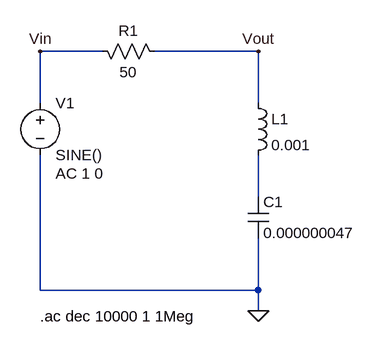
[diagram p0: schematic Notch.asc]
Notch.asc, the LTspice schematic file:
Version 4
SHEET 1 880 680
WIRE 112 32 16 32
WIRE 352 32 192 32
WIRE 16 112 16 32
WIRE 352 112 352 32
WIRE 352 256 352 192
WIRE 16 400 16 192
WIRE 352 400 352 320
WIRE 352 400 16 400
WIRE 352 432 352 400
FLAG 352 432 0
FLAG 16 32 Vin
FLAG 352 32 Vout
SYMBOL voltage 16 96 R0
WINDOW 123 24 124 Left 2
WINDOW 39 0 0 Left 0
SYMATTR InstName V1
SYMATTR Value SINE()
SYMATTR Value2 AC 1 0
SYMBOL res 96 16 M90
WINDOW 0 0 56 VBottom 2
WINDOW 3 32 56 VTop 2
SYMATTR InstName R1
SYMATTR Value 50
SYMBOL ind 336 96 R0
SYMATTR InstName L1
SYMATTR Value 0.001
SYMBOL cap 336 256 R0
SYMATTR InstName C1
SYMATTR Value 0.000000047
TEXT 16 440 Left 2 !.ac dec 10000 1 1Meg

The netlist it stands for:
* Notch.asc
V1 Vin 0 SINE() AC 1 0
R1 Vin Vout 50
L1 Vout N001 0.001
C1 N001 0 0.000000047
.ac dec 10000 1 1Meg
.backanno
.end